# EAGLE board PCB-CMB-5-SHLD-1208 (EAGLE 7.1.0), part 1 of 2
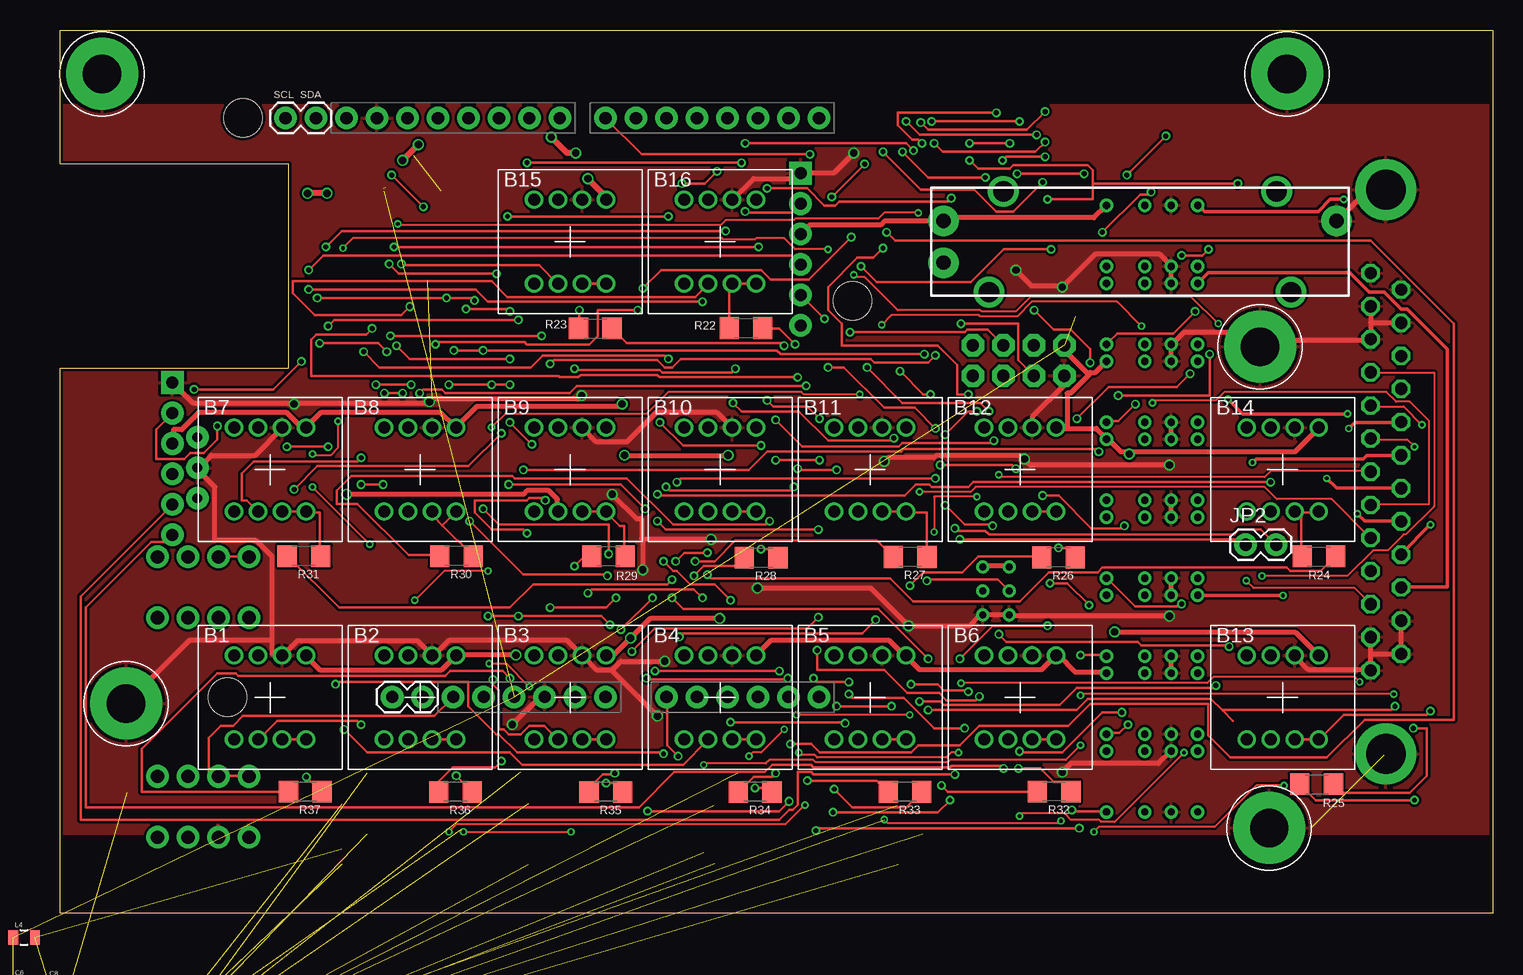
[diagram p5: board, top side]
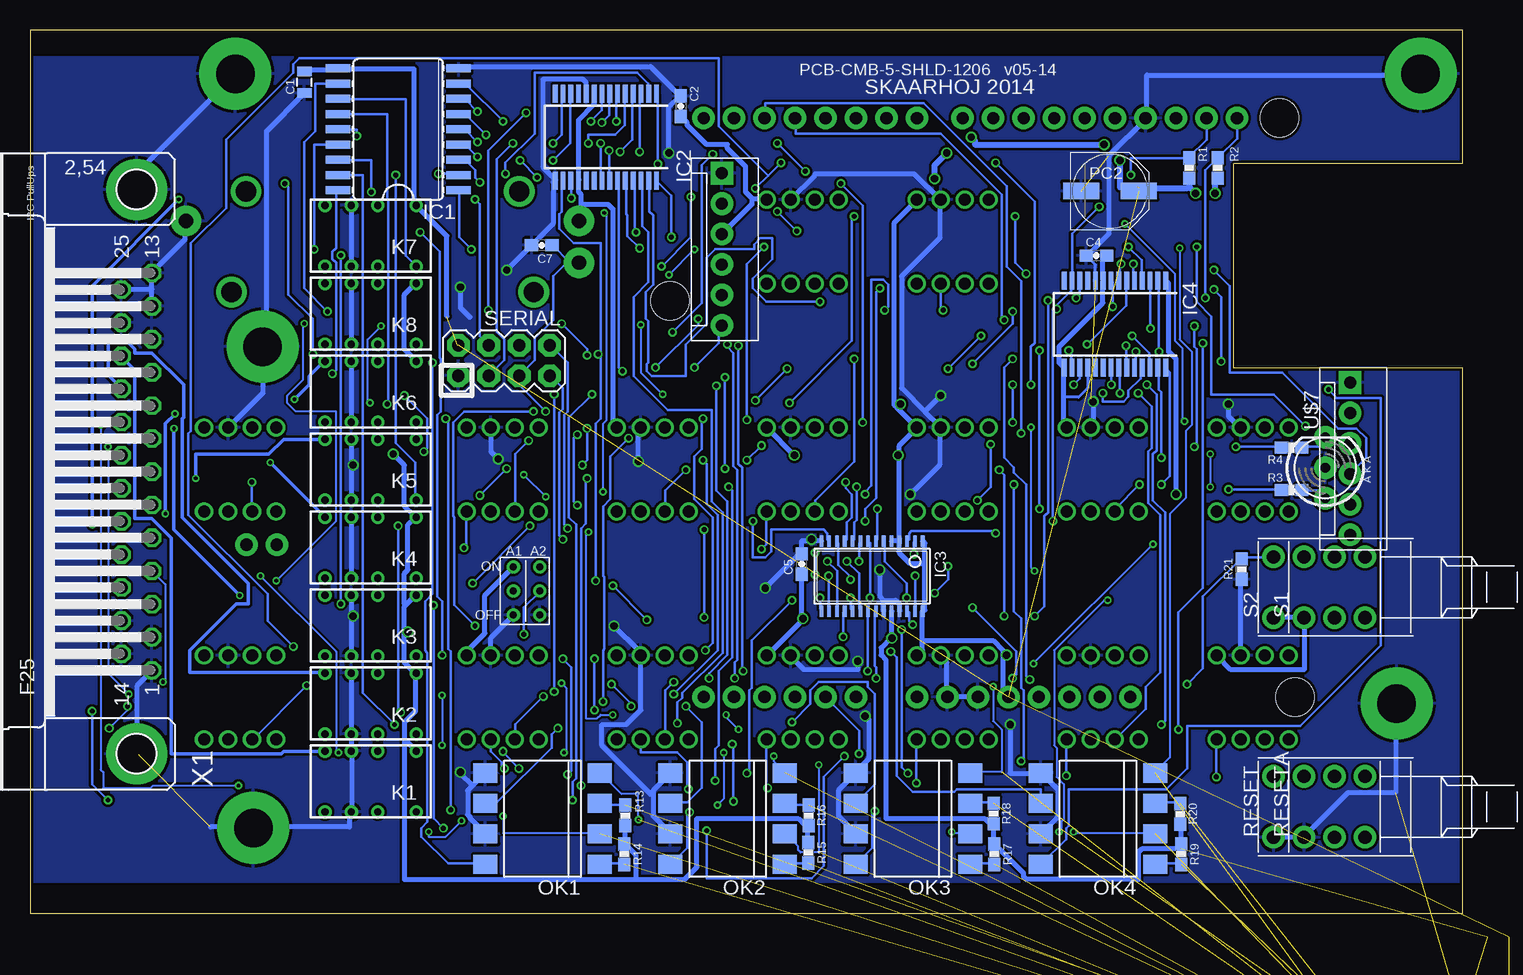
[diagram p6: board, bottom side, seen from below]

Size 119.38 x 73.66 mm. Coordinates in mm from the lower left corner, seen from the top.
Outline: 0,0 0,45.47 19.05,45.47 19.05,62.5 0,62.5 0,73.66 119.38,73.66 119.38,0 0,0
Copper layers (1*16): Top 0.035mm / dielectric 1.5mm / Bottom 0.035mm
Design rules "Fusion_eagle_rule_v1.1": minimum track width 6mil, minimum drill 12mil, track to track 6mil, track to pad 6mil, pad to pad 6mil, via to via 6mil, smd to smd 0mil, copper to edge 10mil, drill to drill 10mil, minimum pad ring 10mil, minimum via ring 6mil, stop-mask expansion 2mil, vias tented up to drill 100mil, thermal gap 10mil
Net classes: 0 default: width 0.203 mm, drill 0.406 mm, clearance 0.203 mm; 1 Power: width 0.508 mm, drill 0.61 mm, clearance 0.203 mm; 2 RELAY LINES: width 0.305 mm, clearance 0.203 mm; 3 INput lines: clearance 0.203 mm
Holes 3.2 mm at 66.04,51.07 15.24,66.31 13.97,18.05
tRestrict: area 0,0 to 120,6.5; area 0,67.5 to 120,74
bRestrict: area 0,71.5 to 120,74; area 0,0 to 120,2.5

## Footprints (pad centres in the part's own frame; a part is rotated, then mirrored left to right if it is on the bottom)
NKK-NP01 = drill 1: 1 1,3.5; 2 -1,-3.5; L1 3,-3.5; L2 1,-3.5; L3 -1,3.5; L4 -3,3.5; LC1 3,3.5; LC2 -3,-3.5
0805 = smd 0.8 x 1.2: 1 -0.9,0; 2 0.9,0
0603-CAP = smd 1.1 x 1: 1 -0.85,0; 2 0.85,0
SOD-323 = smd 0.63 x 0.83: 1 -1.15,0; 2 1.15,0
DUEMILANOVE_VIAS = drill 1.016 pad 1.88: 3.3V 50.8,13.97; 5V 50.8,16.51; A0 50.8,29.21; A1 50.8,31.75; A2 50.8,34.29; A3 50.8,36.83; A4 50.8,39.37; A5 50.8,41.91; AREF 2.54,2.54; D2 2.54,36.83; D3 2.54,34.29; D4 2.54,31.75; D5 2.54,29.21; D6 2.54,26.67; D7 2.54,24.13; D8 2.54,20.32; D9 2.54,17.78; D10 2.54,15.24; D11 2.54,12.7; D12 2.54,10.16; D13 2.54,7.62; GND@0 50.8,19.05; GND@1 50.8,21.59; GND@2 2.54,5.08; RES 50.8,11.43; RX 2.54,41.91; TX 2.54,39.37; VIN 50.8,24.13
SO18W = smd 0.66 x 2.032: 1 -5.08,-5.029; 2 -3.81,-5.029; 3 -2.54,-5.029; 4 -1.27,-5.029; 5 0,-5.029; 6 1.27,-5.029; 7 2.54,-5.029; 8 3.81,-5.029; 9 5.08,-5.029; 10 5.08,5.029; 11 3.81,5.029; 12 2.54,5.029; 13 1.27,5.029; 14 0,5.029; 15 -1.27,5.029; 16 -2.54,5.029; 17 -3.81,5.029; 18 -5.08,5.029
SSOP28 = smd 0.4 x 1.5: 1 -4.225,-3.625; 2 -3.575,-3.625; 3 -2.925,-3.625; 4 -2.275,-3.625; 5 -1.625,-3.625; 6 -0.975,-3.625; 7 -0.325,-3.625; 8 0.325,-3.625; 9 0.975,-3.625; 10 1.625,-3.625; 11 2.275,-3.625; 12 2.925,-3.625; 13 3.575,-3.625; 14 4.225,-3.625; 15 4.225,3.625; 16 3.575,3.625; 17 2.925,3.625; 18 2.275,3.625; 19 1.625,3.625; 20 0.975,3.625; 21 0.325,3.625; 22 -0.325,3.625; 23 -0.975,3.625; 24 -1.625,3.625; 25 -2.275,3.625; 26 -2.925,3.625; 27 -3.575,3.625; 28 -4.225,3.625
TSSOP28 = smd 0.305 x 0.991: 1 -4.225,-2.918; 2 -3.575,-2.918; 3 -2.925,-2.918; 4 -2.275,-2.918; 5 -1.625,-2.918; 6 -0.975,-2.918; 7 -0.325,-2.918; 8 0.325,-2.918; 9 0.975,-2.918; 10 1.625,-2.918; 11 2.275,-2.918; 12 2.925,-2.918; 13 3.575,-2.918; 14 4.225,-2.918; 15 4.225,2.918; 16 3.575,2.918; 17 2.925,2.918; 18 2.275,2.918; 19 1.625,2.918; 20 0.975,2.918; 21 0.325,2.918; 22 -0.325,2.918; 23 -0.975,2.918; 24 -1.625,2.918; 25 -2.275,2.918; 26 -2.925,2.918; 27 -3.575,2.918; 28 -4.225,2.918
1X02 = drill 1.016 pad 1.88: 1 0,0; 2 2.54,0
MOLEX-1X6 = drill 1.016 pad 1.88 square: 1 0,0 | drill 1.016 pad 1.88: 2 2.54,0; 3 5.08,0; 4 7.62,0; 5 10.16,0; 6 12.7,0
DS2Y = drill 0.6: 1 1.2,0.46; 16 1.2,5.54; O1 4.4,0.46; O2 4.4,5.54; P1 6.6,0.46; P2 6.6,5.54; S1 8.8,0.46; S2 8.8,5.54
DIL8-SMD = smd 1.6 x 2: 1 -3.81,-4.77; 2 -1.27,-4.77; 3 1.27,-4.77; 4 3.81,-4.77; 5 3.81,4.77; 6 1.27,4.77; 7 -1.27,4.77; 8 -3.81,4.77
PANASONIC_D = smd 3 x 1.4: + 2.4,0; - -2.4,0
SLIDER20 = drill 1.194 pad 2.54: 1 -16.383,1.74; 2A -16.383,-1.74; 3 16.383,1.74 | drill 1.702: P$1 -11.392,4.191; P$2 11.392,4.191; P$3 12.598,-4.191; P$4 -12.598,-4.191
0603-RES = smd 1.1 x 1: 1 -0.85,0; 2 0.85,0
1206 = smd 1.6 x 1.8: 1 -1.4,0; 2 1.4,0
PUSHBUTTON = drill 1.1 pad 1.88: 1 2.54,2.54; 2 2.54,-2.54; 3 -2.54,2.54; 4 -2.54,-2.54
2X4 = drill 1.016 pad 1.88 octagon: 1 -3.81,-1.27; 2 -3.81,1.27; 3 -1.27,-1.27; 4 -1.27,1.27; 5 1.27,-1.27; 6 1.27,1.27; 7 3.81,-1.27; 8 3.81,1.27
3.2MMPAD6MM = drill 3.2 pad 6: P$1 0,0
LED5MM-BICOLOR = drill 0.813 pad 1.88: A2 2.54,0; A3 -2.54,0; K1 0,0
2BITADDR = drill 0.6: A1 0,0; A2 2.2,0; H2 0,2; H3 2.2,2; L2 0,-2; L3 2.2,-2
F25HP = drill 1.016 octagon: 1 -16.561,-1.27; 2 -13.792,-1.27; 3 -11.049,-1.27; 4 -8.28,-1.27; 5 -5.512,-1.27; 6 -2.769,-1.27; 7 0,-1.27; 8 2.769,-1.27; 9 5.512,-1.27; 10 8.28,-1.27; 11 11.049,-1.27; 12 13.792,-1.27; 13 16.561,-1.27; 14 -15.189,1.27; 15 -12.421,1.27; 16 -9.652,1.27; 17 -6.909,1.27; 18 -4.14,1.27; 19 -1.372,1.27; 20 1.372,1.27; 21 4.14,1.27; 22 6.909,1.27; 23 9.652,1.27; 24 12.421,1.27; 25 15.189,1.27 | drill 3.302 pad 5.08: G1 -23.52,0; G2 23.52,0

## Placement (x,y rotation side)
B1  NKK-NP01-SINGLECOLOR  [NKK-NP01]  17.5,18 0 top
B2  NKK-NP01-SINGLECOLOR  [NKK-NP01]  30,18 0 top
B3  NKK-NP01-SINGLECOLOR  [NKK-NP01]  42.5,18 0 top
B4  NKK-NP01-SINGLECOLOR  [NKK-NP01]  55,18 0 top
B5  NKK-NP01-SINGLECOLOR  [NKK-NP01]  67.5,18 0 top
B6  NKK-NP01-SINGLECOLOR  [NKK-NP01]  80,18 0 top
B7  NKK-NP01-SINGLECOLOR  [NKK-NP01]  17.5,37 0 top
B8  NKK-NP01-SINGLECOLOR  [NKK-NP01]  30,37 0 top
B9  NKK-NP01-SINGLECOLOR  [NKK-NP01]  42.5,37 0 top
B10  NKK-NP01-SINGLECOLOR  [NKK-NP01]  55,37 0 top
B11  NKK-NP01-SINGLECOLOR  [NKK-NP01]  67.5,37 0 top
B12  NKK-NP01-SINGLECOLOR  [NKK-NP01]  80,37 0 top
B13  NKK-NP01-SINGLECOLOR  [NKK-NP01]  101.88,18 0 top
B14  NKK-NP01-SINGLECOLOR  [NKK-NP01]  101.88,37 0 top
B15  NKK-NP01-SINGLECOLOR  [NKK-NP01]  42.5,56 0 top
B16  NKK-NP01-SINGLECOLOR  [NKK-NP01]  55,56 0 top
C1  100nF  [0805]  96.52,69.31 90 bottom
C2  100nF  [0603-CAP]  65.15,67.31 270 bottom
C4  100nF  [0603-CAP]  30.51,54.86 0 bottom
C5  100nF  [0603-CAP]  55.07,29.13 90 bottom
C6  22uF  [0805]  -3,-6 0 top  (outside the outline)
C7  10nF  [0603-CAP]  76.73,55.71 180 bottom
C8  100nF  [0603-CAP]  0,-6 0 top  (outside the outline)
C9  100nF  [0603-CAP]  -3,-10 0 top  (outside the outline)
C10  100nF  [0603-CAP]  -3,-13 0 top  (outside the outline)
C11  100nF  [0603-CAP]  -3,-16 0 top  (outside the outline)
C12  100nF  [0603-CAP]  -3,-19 0 top  (outside the outline)
C13  100nF  [0603-CAP]  -3,-22 0 top  (outside the outline)
D1  1N4148  [SOD-323]  -7,-26 0 top  (outside the outline)
D2  1N4148  [SOD-323]  -3,-26 0 top  (outside the outline)
D3  1N4148  [SOD-323]  -11,-26 0 top  (outside the outline)
D4  1N4148  [SOD-323]  -15,-26 0 top  (outside the outline)
D5  1N4148  [SOD-323]  -19,-26 0 top  (outside the outline)
D6  1N4148  [SOD-323]  -23,-26 0 top  (outside the outline)
D7  1N4148  [SOD-323]  -27,-26 0 top  (outside the outline)
D8  1N4148  [SOD-323]  -31,-26 0 top  (outside the outline)
GND  ARDUINO_SHIELDNO_SILK  [DUEMILANOVE_VIAS]  21.34,68.85 270 top
IC1  ULN2803A  [SO18W]  88.7,65.38 90 bottom
IC2  MCP23017SS  [SSOP28]  71.39,64.73 180 bottom
IC3  PCA9685  [TSSOP28]  49.21,28.12 180 bottom
IC4  MCP23017SS  [SSOP28]  28.97,49.12 180 bottom
JP1  [1X02]  27.69,18.05 0 top
JP2  [1X02]  98.81,30.75 0 top
JP3  [MOLEX-1X6]  61.72,61.72 270 bottom
JP4  [1X02]  21.34,66.31 180 top
JP5  [MOLEX-1X6]  9.36,44.26 270 bottom
K1  RELAY5VIM03  [DS2Y]  86,14 180 bottom
K2  RELAY5VIM03  [DS2Y]  86,20.5 180 bottom
K3  RELAY5VIM03  [DS2Y]  86,27 180 bottom
K4  RELAY5VIM03  [DS2Y]  86,33.5 180 bottom
K5  RELAY5VIM03  [DS2Y]  86,40 180 bottom
K6  RELAY5VIM03  [DS2Y]  86,46.5 180 bottom
K7  RELAY5VIM03  [DS2Y]  86,59.5 180 bottom
K8  RELAY5VIM03  [DS2Y]  86,53 180 bottom
L4  ILHB0805ER121V  [0805]  -3,-2 0 top
OK1  LTV826S  [DIL8-SMD]  76.67,7.9 90 bottom
OK2  LTV826S  [DIL8-SMD]  61.24,7.9 90 bottom
OK3  LTV826S  [DIL8-SMD]  45.81,7.9 90 bottom
OK4  LTV826S  [DIL8-SMD]  30.38,7.9 90 bottom
PC2  47u  [PANASONIC_D]  29.38,60.24 0 bottom
POT1  10K Linear  [SLIDER20]  90,56 0 top
R1  1K5  [0603-RES]  22.77,62.15 270 bottom
R2  1K5  [0603-RES]  20.4,62.15 270 bottom
R3  270  [0603-RES]  14.24,35.29 180 bottom
R4  270  [0603-RES]  14.24,38.83 180 bottom
R13  330R  [0603-RES]  69.76,8.18 90 bottom
R14  330R  [0603-RES]  69.86,4.93 270 bottom
R15  330R  [0603-RES]  54.53,5.06 270 bottom
R16  330R  [0603-RES]  54.47,8.18 90 bottom
R17  330R  [0603-RES]  39.03,4.93 270 bottom
R18  330R  [0603-RES]  39.06,8.32 90 bottom
R19  330R  [0603-RES]  23.46,4.93 270 bottom
R20  330R  [0603-RES]  23.52,8.3 90 bottom
R21  10K  [0603-RES]  18.41,28.72 90 bottom
R22  100R  [1206]  57.16,48.8 0 top
R23  100R  [1206]  44.61,48.77 0 top
R24  100R  [1206]  104.91,29.77 0 top
R25  100R  [1206]  104.72,10.77 0 top
R26  100R  [1206]  83.2,29.68 180 top
R27  100R  [1206]  70.84,29.72 180 top
R28  100R  [1206]  58.43,29.65 180 top
R29  100R  [1206]  45.71,29.78 180 top
R30  100R  [1206]  33.04,29.8 180 top
R31  100R  [1206]  20.32,29.8 180 top
R32  100R  [1206]  82.84,10.16 180 top
R33  100R  [1206]  70.41,10.14 180 top
R34  100R  [1206]  57.93,10.12 180 top
R35  100R  [1206]  45.48,10.12 180 top
R36  100R  [1206]  32.96,10.12 180 top
R37  100R  [1206]  20.43,10.15 180 top
RESET  [PUSHBUTTON]  13.21,8.89 90 bottom
RESETA  [PUSHBUTTON]  10.67,8.89 90 bottom
S1  [PUSHBUTTON]  10.67,27.19 90 bottom
S2  [PUSHBUTTON]  13.21,27.19 90 bottom
SERIAL  M04X2  [2X4]  79.88,46.1 0 bottom
U$4  GNDPAD6MM  [3.2MMPAD6MM]  100,47.25 0 top
U$7  LEDBICOLOR-AKA  [LED5MM-BICOLOR]  11.44,37.16 90 bottom
U$15  GNDPAD6MM  [3.2MMPAD6MM]  100.77,7.12 0 top
U$18  GNDPAD6MM  [3.2MMPAD6MM]  102.26,70 0 top
U$19  2BITADDR  [2BITADDR]  79.1,26.89 0 bottom
U$20  GNDPAD6MM  [3.2MMPAD6MM]  5.5,17.5 0 top
U$21  GNDPAD6MM  [3.2MMPAD6MM]  3.5,70 0 top
X1  DB25F  [F25HP]  110.49,36.83 90 bottom